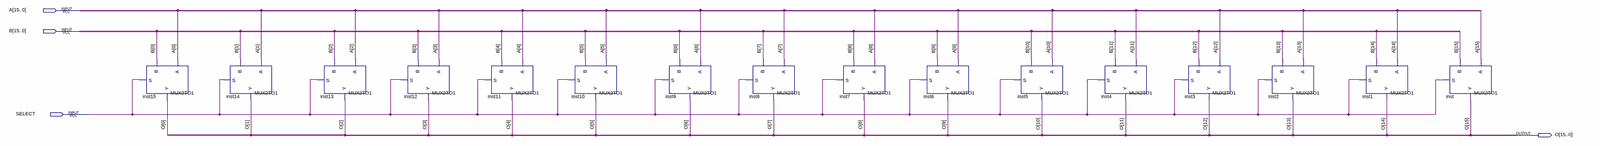
[diagram p0: schematic sheet, whole]
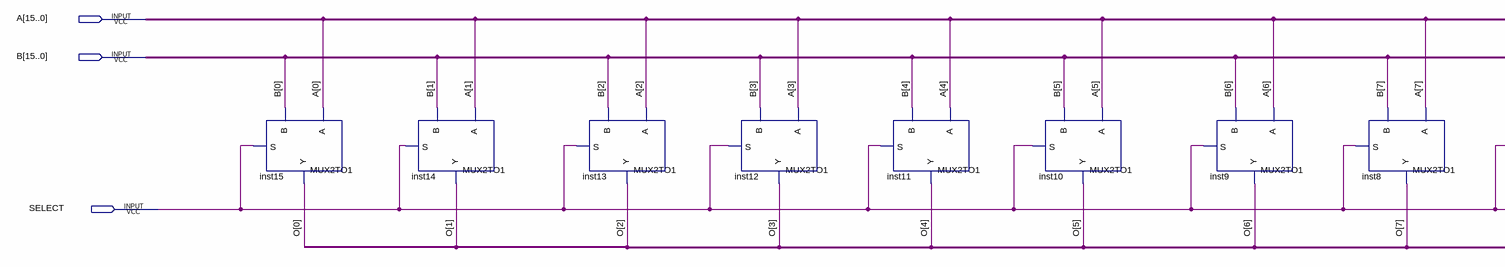
[diagram p1: schematic sheet, left part]
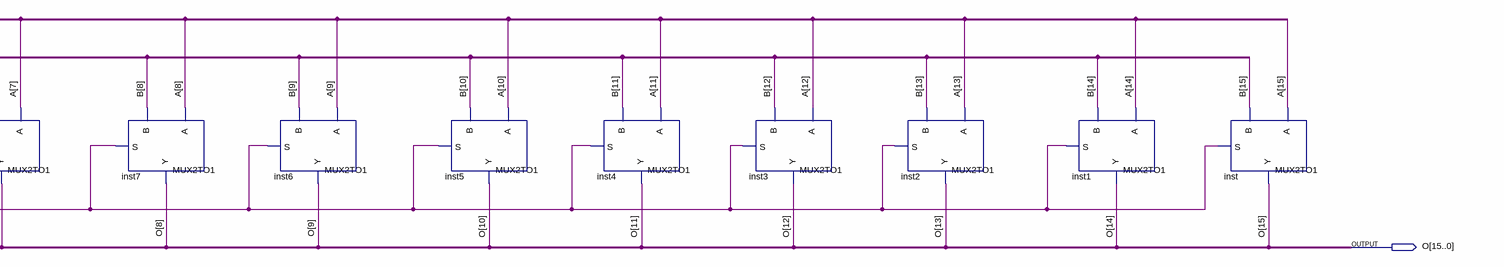
[diagram p2: schematic sheet, right part]
// Quartus schematic MUX2TO116BIT.bdf as structural Verilog: 16 symbols, 4 pins
module MUX2TO116BIT (
  input  [15:0] A,
  input  [15:0] B,
  input  SELECT,
  output [15:0] O
);

  MUX2TO1 inst15 (.S(SELECT), .A(A[0]), .B(B[0]), .Y(O[0]));
  MUX2TO1 inst14 (.S(SELECT), .A(A[1]), .B(B[1]), .Y(O[1]));
  MUX2TO1 inst13 (.S(SELECT), .A(A[2]), .B(B[2]), .Y(O[2]));
  MUX2TO1 inst12 (.S(SELECT), .A(A[3]), .B(B[3]), .Y(O[3]));
  MUX2TO1 inst11 (.S(SELECT), .A(A[4]), .B(B[4]), .Y(O[4]));
  MUX2TO1 inst10 (.S(SELECT), .A(A[5]), .B(B[5]), .Y(O[5]));
  MUX2TO1 inst9 (.S(SELECT), .A(A[6]), .B(B[6]), .Y(O[6]));
  MUX2TO1 inst8 (.S(SELECT), .A(A[7]), .B(B[7]), .Y(O[7]));
  MUX2TO1 inst7 (.S(SELECT), .A(A[8]), .B(B[8]), .Y(O[8]));
  MUX2TO1 inst6 (.S(SELECT), .A(A[9]), .B(B[9]), .Y(O[9]));
  MUX2TO1 inst5 (.S(SELECT), .A(A[10]), .B(B[10]), .Y(O[10]));
  MUX2TO1 inst4 (.S(SELECT), .A(A[11]), .B(B[11]), .Y(O[11]));
  MUX2TO1 inst3 (.S(SELECT), .A(A[12]), .B(B[12]), .Y(O[12]));
  MUX2TO1 inst2 (.S(SELECT), .A(A[13]), .B(B[13]), .Y(O[13]));
  MUX2TO1 inst1 (.S(SELECT), .A(A[14]), .B(B[14]), .Y(O[14]));
  MUX2TO1 inst (.S(SELECT), .A(A[15]), .B(B[15]), .Y(O[15]));
endmodule
